# EAGLE design reciever_pcb (EAGLE 7.3.0)
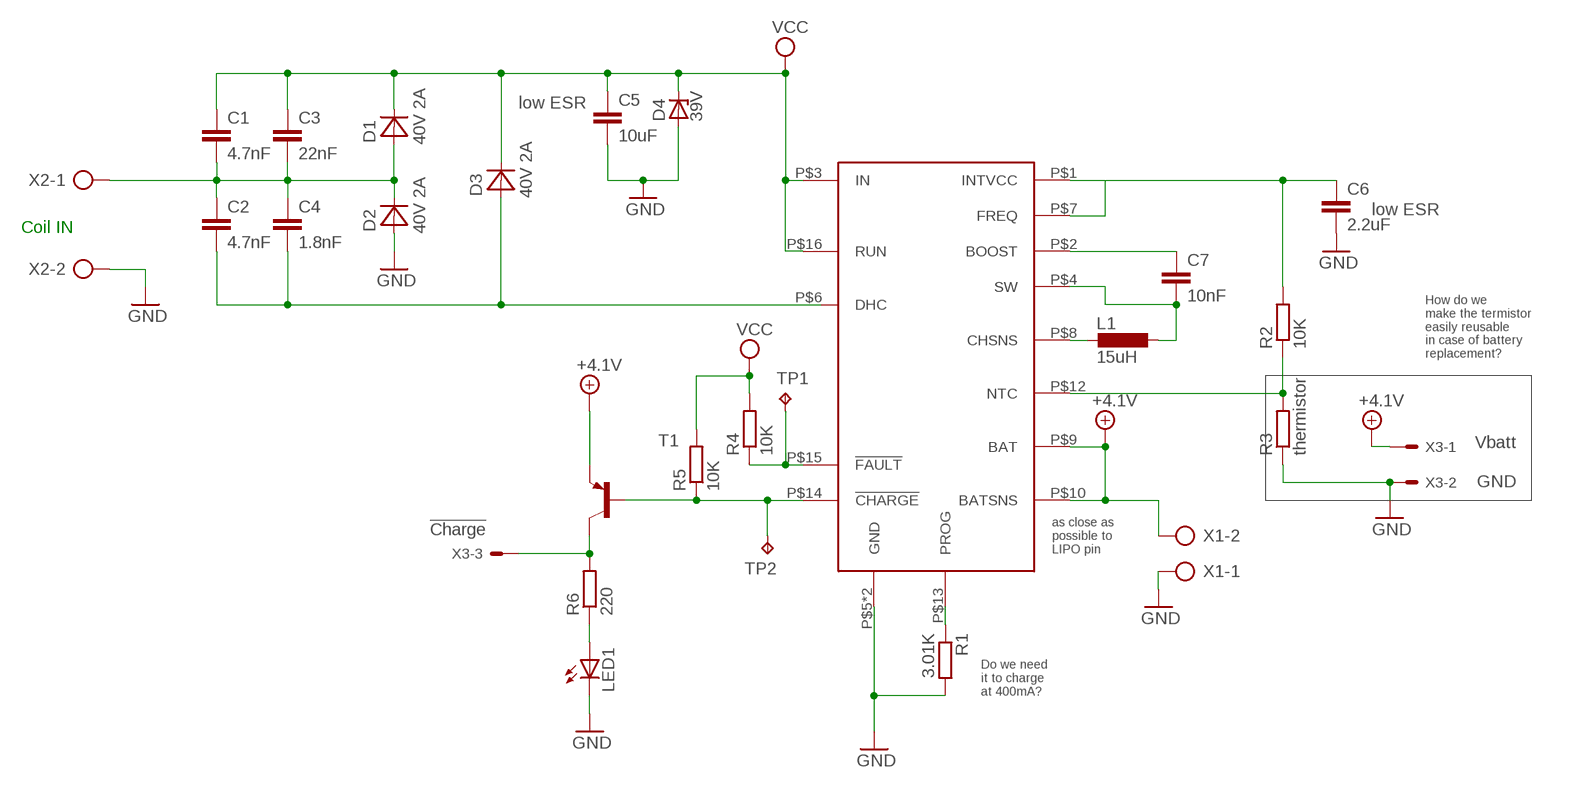
[diagram p0: schematic, sheet 1]

## Parts
C1  4.7nF  C-EUC0805  [C0805]
C2  4.7nF  C-EUC0805  [C0805]
C3  22nF  C-EUC0805  [C0805]
C4  1.8nF  C-EUC0805  [C0805]
C5  10uF  C-EUC0805  [C0805]
C6  2.2uF  C-EUC0805  [C0805]
C7  10nF  C-EUC0805  [C0805]
D1  40V 2A  MBRA340T3  [SMA]
D2  40V 2A  MBRA340T3  [SMA]
D3  40V 2A  MBRA340T3  [SMA]
D4  39V  ZENER-DIODESMB  [SMB]
L1  15uH  L-EUL1812  [L1812]
LED1  LEDCHIP-LED0805  [CHIP-LED0805]
R1  3.01K  R-EU_R0805  [R0805]
R2  10K  R-EU_R0805  [R0805]
R3  thermistor  R-EU_0207/2V  [0207/2V]
R4  10K  R-EU_R0805  [R0805]
R5  10K  R-EU_R0805  [R0805]
R6  220  R-EU_R0805  [R0805]
T1  -PNP-SOT23-BCE  [SOT23-BCE]
TP1  TPTP19R  [TP19R]
TP2  TPTP19R  [TP19R]
U$1  LT4120  [QFN16]
X1  AK500/2  [AK500/2]
X2  AK500/2  [AK500/2]
X3  KK-156-3  [KK-156-3]

## Nets
+4.1V: T1.E U$1.P$9(BAT) U$1.P$10(BATSNS) X1.2 X3.1
GND: C5.2 C6.2 D2.A D4.A LED1.C R1.2 R3.1 U$1.P$5(GND) U$1.P$17(GND) X1.1 X2.2 X3.2
N$1: C1.2 C2.1 C3.2 C4.1 D1.A D2.C X2.1
N$2: C2.2 C4.2 D3.A
N$3: C6.1 R2.2 U$1.P$1(INTVCC) U$1.P$7(FREQ)
N$4: C7.1 U$1.P$2(BOOST)
N$5: C7.2 L1.1 U$1.P$4(SW)
N$6: L1.2 U$1.P$8(CHSNS)
N$7: R1.1 U$1.P$13(PROG)
N$8: R2.1 R3.2 U$1.P$12(NTC)
N$9: R5.1 T1.B TP2.TP U$1.P$14(!CHARGE)
N$10: R4.1 TP1.TP U$1.P$15(!FAULT)
N$11: LED1.A R6.1
N$12: R6.2 T1.C X3.3
VCC: C1.1 C3.1 C5.1 D1.C D3.C D4.C R4.2 R5.2 U$1.P$3(IN) U$1.P$16(RUN)
Unconnected: U$1.P$6(DHC)

## Notes on the sheet
- low ESR
- low ESR
- Coil IN
- How do we
  make the termistor
  easily reusable
  in case of battery
  replacement?
- Vbatt
- GND
- !Charge
- as close as 
  possible to
  LIPO pin
- Do we need
  it to charge
  at 400mA?

## Library data of the parts
C1-C7 = rcl:C-EU: CAPACITOR, European symbol
D1-D3 = diode:MBRA340T3: Surface Mount Schottky Power Rectifier Source: http://www.onsemi.com/pub_link/Collateral/MBRA340T3-D.PDF
D4 = diode:ZENER-DIODE: Z-Diode
L1 = rcl:L-EU: INDUCTOR, European symbol
LED1 = led:LED: LED OSRAM: - CHIPLED LG R971, LG N971, LY N971, LG Q971, LY Q971, LO R971, LY R971 LH N974, LH R974 LS Q976, LO Q976, LY Q976 LO Q996 - Hyper CHIPLED LW Q18S LB Q993, LB Q99A, LB R99A - SideLED LS A670, LO A670, LY A670, LG A670, LP A670 LB A673, LV A673, LT A673, LW A673 LH A674 LY A675 LS A676, LA A676, LO A676, LY A676, LW A676 LS A679, LY A679, LG A679 - Hyper Micro SIDELED® LS Y876, LA Y876, LO Y876, LY Y876 LT Y87S - SmartLED LW L88C, LW L88S LB L89C, LB L89S, LG L890 LS L89K, LO L89K, LY L89K LS L896, LA L896, LO L896, LY L896 - TOPLED LS T670, LO T670, LY T670, LG T670, LP T670 LSG T670, LSP T670, LSY T670, LOP T670, LYG T670 LG T671, LOG T671, LSG T671 LB T673, LV T673, LT T673, LW T673 LH T674 LS T676, LA T676, LO T676, LY T676, LB T676, LH T676, LSB T676, LW T676 LB T67C, LV T67C, LT T67C, LS T67K, LO T67K, LY T67K, LW E67C LS E67B, LA E67B, LO E67B, LY E67B, LB E67C, LV E67C, LT E67C LW T67C LS T679, LY T679, LG T679 LS T770, LO T770, LY T770, LG T770, LP T770 LB T773, LV T773, LT T773, LW T773 LH T774 LS E675, LA E675, LY E675, LS T675 LS T776, LA T776, LO T776, LY T776, LB T776 LHGB T686 LT T68C, LB T68C - Hyper Mini TOPLED® LB M676 - Mini TOPLED Santana® LG M470 LS M47K, LO M47K, LY M47K Source: http://www.osram.convergy.de LUXEON: - LUMILED® LXK2-PW12-R00, LXK2-PW12-S00, LXK2-PW14-U00, LXK2-PW14-V00 LXK2-PM12-R00, LXK2-PM12-S00, LXK2-PM14-U00 LXK2-PE12-Q00, LXK2-PE12-R00, LXK2-PE12-S00, LXK2-PE14-T00, LXK2-PE14-U00 LXK2-PB12-K00, LXK2-PB12-L00, LXK2-PB12-M00, LXK2-PB14-N00, LXK2-PB14-P00, LXK2-PB14-Q00 LXK2-PR12-L00, LXK2-PR12-M00, LXK2-PR14-Q00, LXK2-PR14-R00 LXK2-PD12-Q00, LXK2-PD12-R00, LXK2-PD12-S00 LXK2-PH12-R00, LXK2-PH12-S00 LXK2-PL12-P00, LXK2-PL12-Q00, LXK2-PL12-R00 Source: www.luxeon.com KINGBRIGHT: KA-3528ASYC Source: www.kingbright.com
R1-R6 = rcl:R-EU_: RESISTOR, European symbol
T1 = transistor:*-PNP-: PNP Transistror
TP1 TP2 = testpad:TP: Test pad
U$1 = custom parts:LT4120
X1 X2 = con-ptr500:AK500/2: CONNECTOR; OC_FARNELL: unknown; OC_NEWARK: unknown
X3 = con-molex:KK-156-3: KK 156 HEADER Source: http://www.molex.com/pdm_docs/sd/026604100_sd.pdf; OC_FARNELL: unknown; OC_NEWARK: unknown

## Board
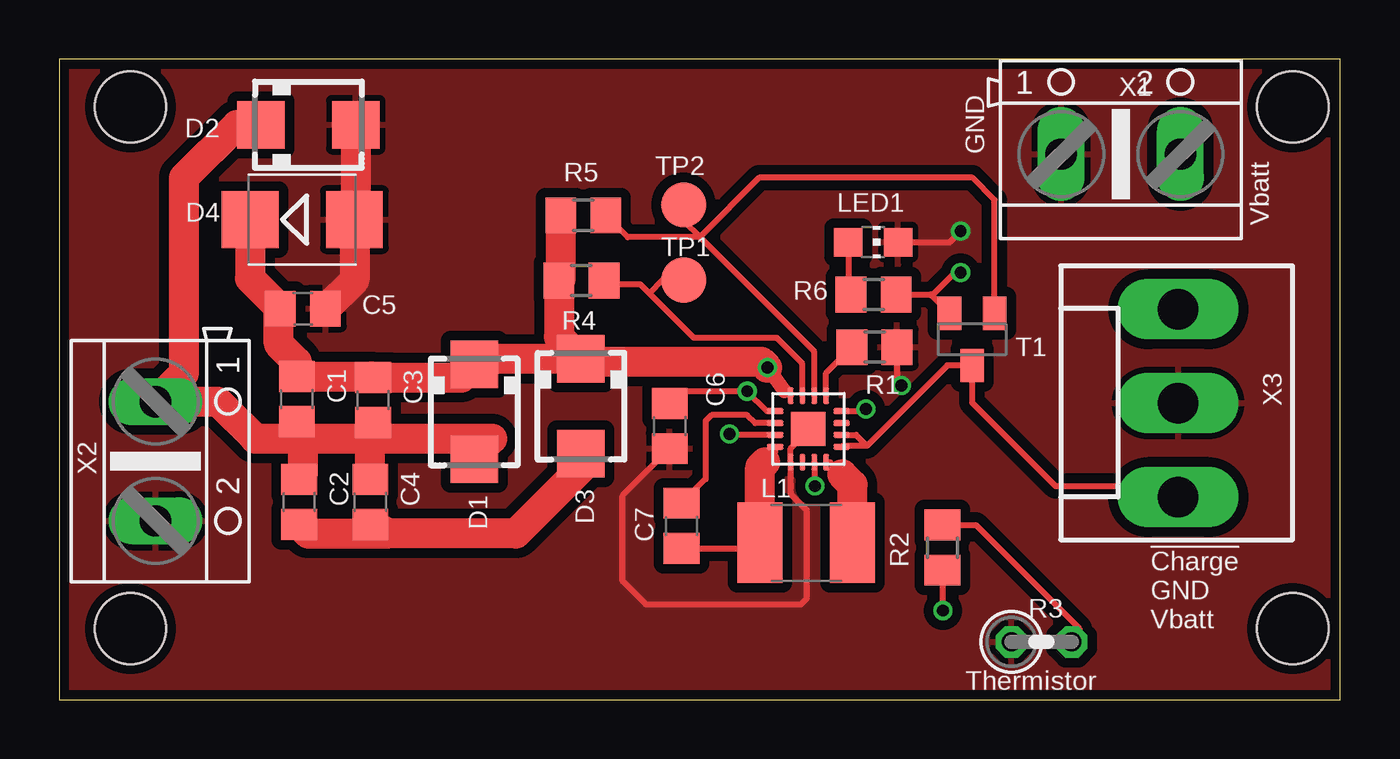
[diagram p1: board, top side]
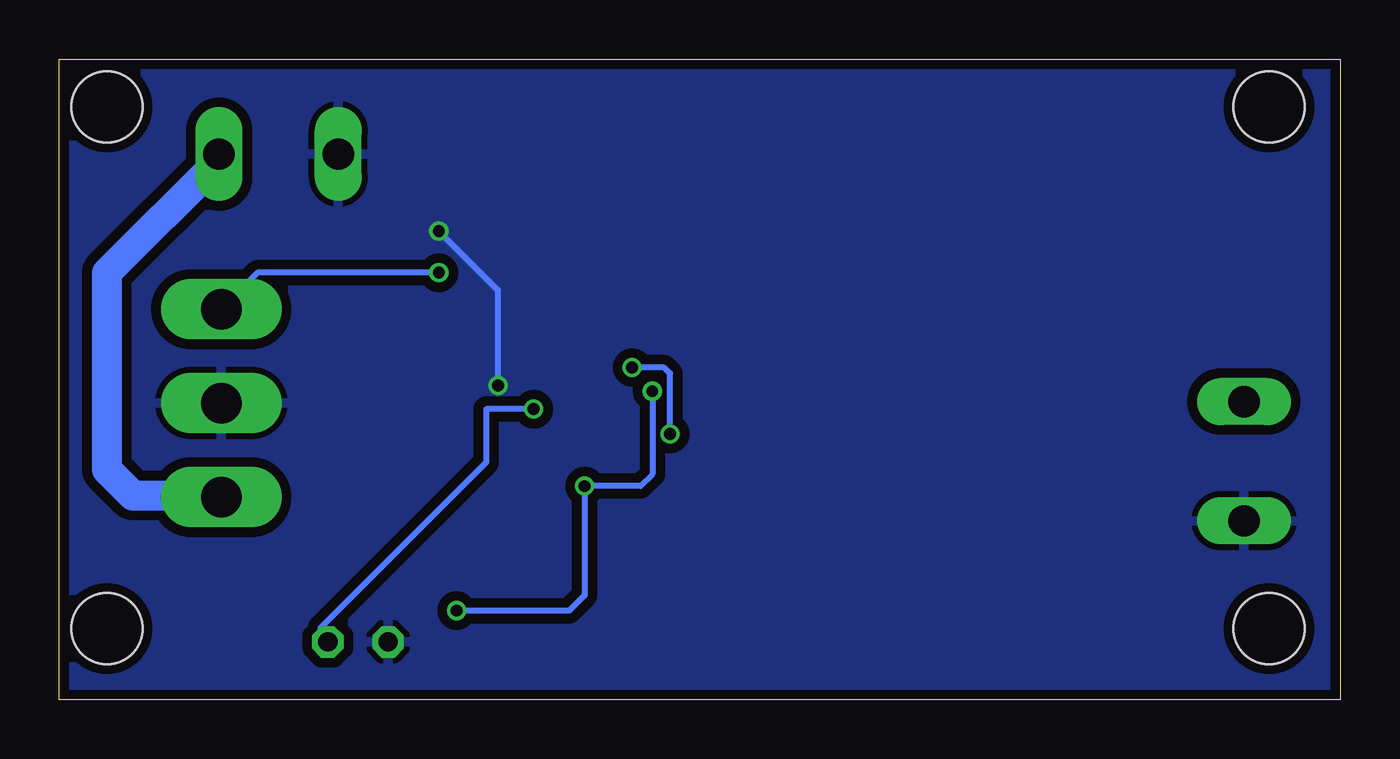
[diagram p2: board, bottom side, seen from below]

Size 54 x 27 mm. Coordinates in mm from the lower left corner, seen from the top.
Outline: 0,0 54,0 54,27 0,27 0,0
Copper layers (1*16): Top 0.035mm / dielectric 1.5mm / Bottom 0.035mm
Design rules "dirt_cheap_dirty_boards.v1": minimum track width 5mil, minimum drill 12mil, track to track 5mil, track to pad 5mil, pad to pad 5mil, via to via 5mil, smd to smd 0mil, copper to edge 10mil, drill to drill 10mil, minimum pad ring 10mil, minimum via ring 6mil, stop-mask expansion 2mil, vias tented up to drill 25mil, thermal gap 10mil
Holes 3 mm at 3,25 3,3 52,3 52,25

### Footprints (pad centres in the part's own frame; a part is rotated, then mirrored left to right if it is on the bottom)
C0805 = smd 1.3 x 1.5: 1 -0.95,0; 2 0.95,0
SMA = smd 2 x 2: A 2,0; C -2,0
SMB = smd 2.4 x 2.4: A 2.2,0; C -2.2,0
L1812 = smd 1.9 x 3.4: 1 -1.95,0; 2 1.95,0
CHIP-LED0805 = smd 1.2 x 1.2: A 0,-1.05; C 0,1.05
R0805 = smd 1.3 x 1.5: 1 -0.95,0; 2 0.95,0
0207/2V = drill 0.813 octagon: 1 -1.27,0; 2 1.27,0
SOT23-BCE = smd 1 x 1.4: B -0.95,-1.1; C 0.95,-1.1; E 0,1.1
TP19R = smd 1.9 x 1.9: TP 0,0
QFN16 = smd 0.7 x 0.25: P$1 -1.4,0.75; P$2 -1.4,0.25; P$3 -1.4,-0.25; P$4 -1.4,-0.75; P$9 1.4,-0.75; P$10 1.4,-0.25; P$11 1.4,0.25; P$12 1.4,0.75 | smd 0.25 x 0.7: P$5 -0.75,-1.4; P$6 -0.25,-1.4; P$7 0.25,-1.4; P$8 0.75,-1.4; P$13 0.75,1.4; P$14 0.25,1.4; P$15 -0.25,1.4; P$16 -0.75,1.4 | smd 1.45 x 1.45: P$17 0,0
AK500/2 = drill 1.321 long: 1 -2.515,0; 2 2.515,0
KK-156-3 = drill 1.7 pad 2.184 long: 1 -3.96,0; 2 0,0; 3 3.96,0

### Placement (x,y rotation side)
C1  10.01,12.68 270 top
C2  10.11,8.33 270 top
C3  13.23,12.63 270 top
C4  13.11,8.33 270 top
C5  10.27,16.48 0 top
C6  25.73,11.53 270 top
C7  26.23,7.33 270 top
D1  17.49,12.13 270 top
D2  10.5,24.24 0 top
D3  21.99,12.37 270 top
D4  10.24,20.24 0 top
L1  31.49,6.61 0 top
LED1  34.31,19.29 270 top
R1  34.37,14.86 0 top
R2  37.23,6.41 270 top
R3  41.41,2.43 0 top
R4  22.01,17.67 180 top
R5  22.09,20.42 180 top
R6  34.33,17.08 0 top
T1  38.48,15.19 180 top
TP1  26.32,17.69 0 top
TP2  26.32,20.86 0 top
U$1  31.58,11.41 0 top
X1  44.75,23 0 top
X2  4.06,10.05 270 top
X3  47.17,12.5 90 top

### Tracks (layer width: path | path; a pad name or v marks a point on that pad's centre or on a via)
+4.1V
  Top 0.254: U$1.P$10 33.59,11.16 34.05,10.7 | 34.05,10.7 33.02,10.7 U$1.P$9 | 34.05,10.7 37.44,14.09 T1.E 38.48,12.52 42,9 46.71,9 X3.1
  Bottom 1.27: X1.2 47.27,22.73 52,18 52,9.7 50.9,8.6 47.23,8.6 X3.1
GND  (via drill 0.5)
  Top 0.254: C6.2 23.75,8.6 23.75,5 24.75,4 31.25,4 31.5,4.25 31.5,8 30.83,8.67 U$1.P$5 30.83,10.58 31.25,11 31.25,11.08 U$1.P$17 | LED1.C 37.54,19.29 v38,19.75 | R1.2 35.32,13.43 v35.5,13.25
  Top 1.27: D2.A 12.5,20.3 D4.A 12.44,17.7 C5.2
  Bottom 0.254: v35.5,13.25 35.5,17.25 v38,19.75
  pour Top (isolate 0.406, rank 3): 0.25,0 30.25,0 54.25,0.25 54.25,27 0.25,27
  pour Bottom (isolate 0.406): 0,0 0,27 54,27 54,0
N$1
  Top 1.27: 10.25,11 8.25,11 6.68,12.56 X2.1 5.25,13.76 5.25,22 7.49,24.24 D2.C | 10.25,11 13.25,11 | 13.25,11 18.25,11 17.49,10.24 D1.A | C4.1 13.11,10.86 13.25,11 | C3.2 13.23,11.02 13.25,11 | C1.2 10.01,11.24 10.25,11 | 10.25,11 10.25,9.42 C2.1
N$2
  Top 1.27: D3.A 21.99,9.74 19.25,7 13.84,7 13.75,7.07 | 13.75,7.07 C4.2 | C2.2 10.5,7 13.68,7 13.75,7.07
N$3  (via drill 0.5)
  Top 0.254: U$1.P$1 29.84,12.16 v29,13 26,13 C6.1 | v31.85,9 31.85,9.99 U$1.P$7 | v37.25,3.75 37.25,5.44 R2.2
  Bottom 0.254: v29,13 29,9.5 29.5,9 v31.85,9 31.85,4.4 32.5,3.75 v37.25,3.75
N$4
  Top 0.254: U$1.P$2 29.34,11.66 29,12 27.5,12 27.25,11.75 27.25,9.3 C7.1
N$5
  Top 0.254: U$1.P$4 30.18,10.43 29.75,10 | C7.2 29.31,6.38 L1.1
  Top 1.27: L1.1 29.54,9.79 29.75,10
N$6
  Top 0.254: U$1.P$8 32.49,10.01 33,9.5
  Top 1.27: L1.2 33.44,9.06 33,9.5
N$7
  Top 0.254: U$1.P$13 32.33,13.77 R1.1
N$8  (via drill 0.5)
  Top 0.254: U$1.P$12 33.91,12.16 v34,12.25 | R2.1 38.64,7.36 43,3 43,2.75 R3.2
  Bottom 0.254: v34,12.25 36,12.25 36,10 43,3 43,2.75 R3.2
N$9
  Top 0.254: U$1.P$14 31.83,14.67 27,19.5 | 27,19.5 23.96,19.5 R5.1 | TP2.TP 26.32,20.18 27,19.5 | T1.B 39.43,21.07 38.5,22 29.5,22 27,19.5
N$10
  Top 0.254: U$1.P$15 31.33,14.17 30.25,15.25 26.75,15.25 24.88,17.12 | 24.88,17.12 24.5,17.5 23.13,17.5 R4.1 | TP1.TP 25.44,17.69 24.88,17.12
N$11
  Top 0.254: LED1.A 33.26,17.2 R6.1
N$12  (via drill 0.5)
  Top 0.254: R6.2 36.74,17.08 36.78,17.04 | 36.78,17.04 T1.C | v38,18 37.75,18 36.78,17.04
  Bottom 0.254: v38,18 45.63,18 X3.3
VCC  (via drill 0.5)
  Top 0.254: U$1.P$3 28.29,11.16 v28.25,11.2 | 30.85,12.83 U$1.P$16 30.58,13.02
  Top 0.61: 30.58,13.02 v29.85,14
  Top 1.27: D3.C 17.73,14.37 D1.C 16.94,13.58 C3.1 13.18,13.63 C1.1 10.01,14.24 9.25,15 9.25,16.41 C5.1 8.04,17.76 D4.C | D3.C 21.06,15.3 R4.2 21.14,17.75 R5.2 | D3.C 22.63,14.37 22.75,14.25 29.6,14.25 v29.85,14
  Bottom 0.254: v28.25,11.2 28.25,13.75 28.5,14 v29.85,14

### Text on the board
tNames: GND | Vbatt | !Charge / GND / Vbatt | Thermistor